# Altium schematic sheet User_Interface.SchDoc
size A4; SheetNumber: 9; SheetTotal: 9
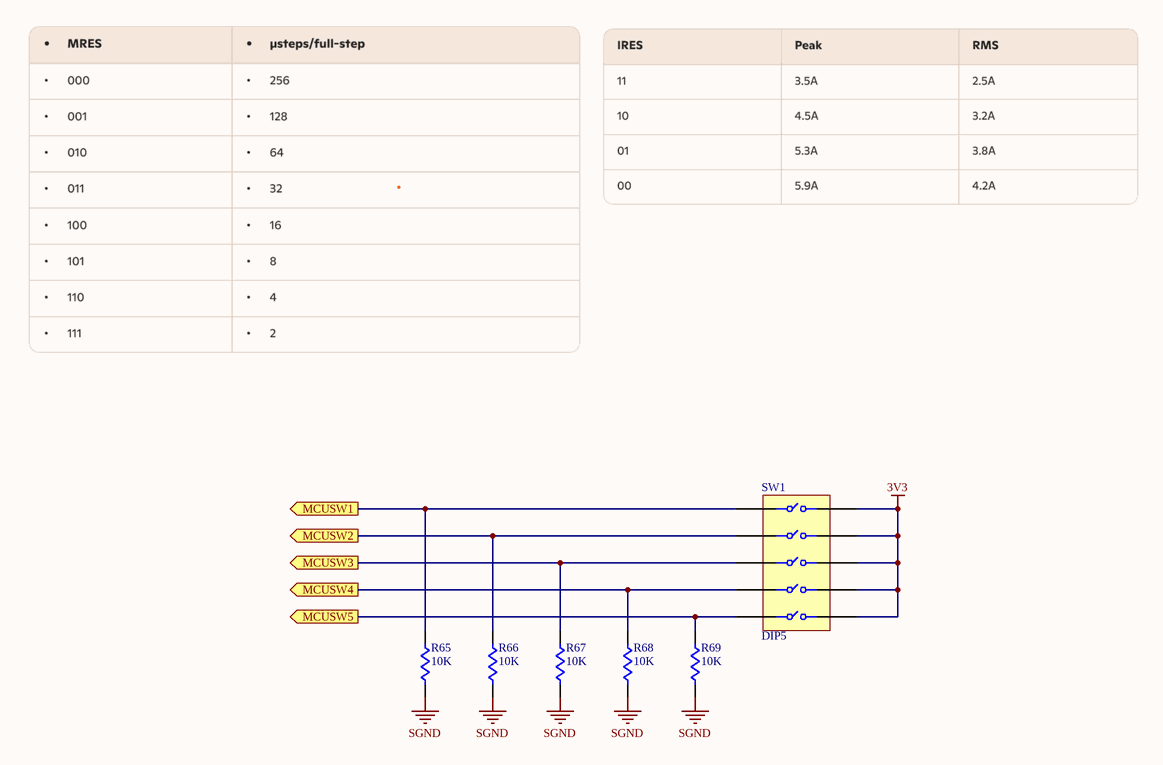
[diagram p0: User_Interface.SchDoc]

## Parts
R65  10K  [RES: 0603]
R66  10K  [RES: 0603]
R67  10K  [RES: 0603]
R68  10K  [RES: 0603]
R69  10K  [RES: 0603]
SW1  DIP5  [DIPSW254_5]

## Ports
MCUSW1 (out), MCUSW2 (out), MCUSW3 (out), MCUSW4 (out), MCUSW5 (out)

## Nets
3V3: SW1.6(NO_5) SW1.7(NO_4) SW1.8(NO_3) SW1.9(NO_2) SW1.10(NO_1)
SGND: R65.2 R66.2 R67.2 R68.2 R69.2
MCUSW1: R65.1 SW1.1(COM1) ; port MCUSW1
MCUSW2: R66.1 SW1.2(COM2) ; port MCUSW2
MCUSW3: R67.1 SW1.3(COM3) ; port MCUSW3
MCUSW4: R68.1 SW1.4(COM4) ; port MCUSW4
MCUSW5: R69.1 SW1.5(COM5) ; port MCUSW5

## Notes on the sheet
- Size:
- Date:
- Sheet Name:
- A4
- Sheet
- Time:
- of
- Author :
- Hatim Saad
- Project:
- File:

## Library data of the parts
R65-R69 = RES 0603: RES SMD 0603
SW1 = DIP SW_5: DIP Switch 5